# Altium schematic sheet MCU.SchDoc
size A4
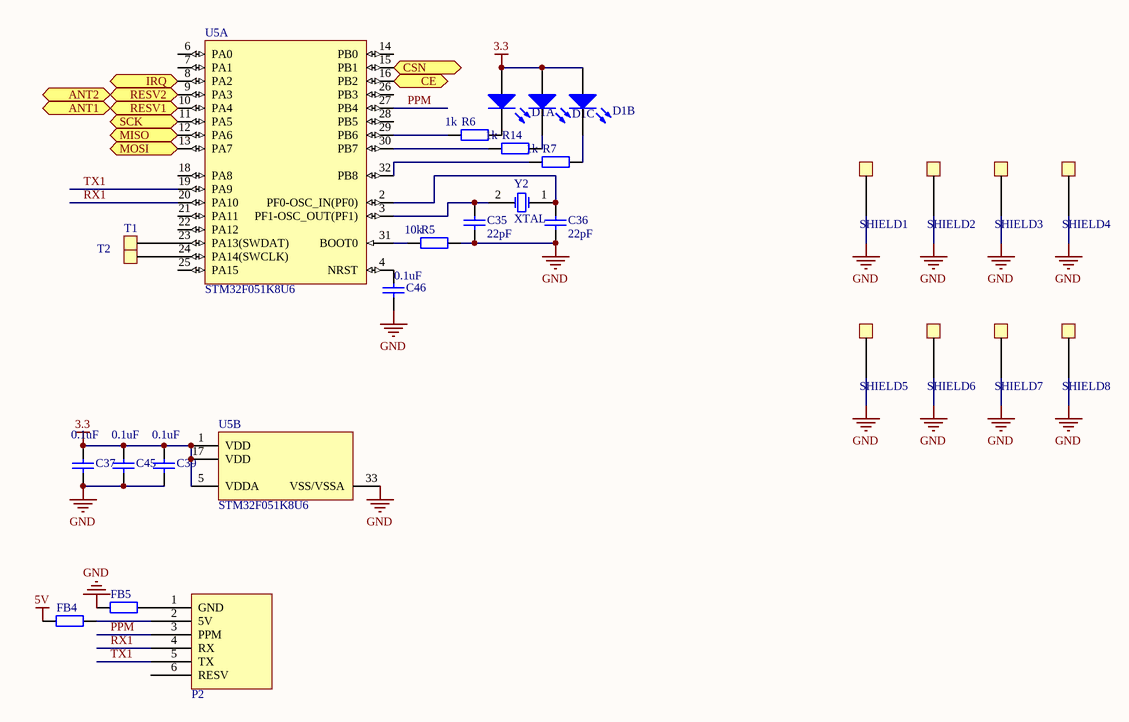
[diagram p0: MCU.SchDoc]

## Parts
C35  22pF  [0402]
C36  22pF  [0402]
C37  0.1uF  [0402]
C39  0.1uF  [0402]
C45  0.1uF  [0402]
C46  0.1uF  [0402]
D1  LEDx3  [LC-0603_Rx2]  (value not drawn)  (parts A,B,C of 3)
FB4  Res2  [0402]  (value not drawn)
FB5  Res2  [0402]  (value not drawn)
P2  PPMInf  [PPMInf]  (value not drawn)
R5  10k  [0402]
R6  1k  [0402]
R7  1k  [0402]
R14  1k  [0402]
SHIELD1  D  [ShieldHolder_6.5*0.8]  (value not drawn)
SHIELD2  D  [ShieldHolder_6.5*0.8]  (value not drawn)
SHIELD3  D  [ShieldHolder_6.5*0.8]  (value not drawn)
SHIELD4  D  [ShieldHolder_6.5*0.8]  (value not drawn)
SHIELD5  D  [ShieldHolder_6.5*0.8]  (value not drawn)
SHIELD6  D  [ShieldHolder_6.5*0.8]  (value not drawn)
SHIELD7  D  [ShieldHolder_6.5*0.8]  (value not drawn)
SHIELD8  D  [ShieldHolder_6.5*0.8]  (value not drawn)
T1  D  [TestPad - 1mm]  (value not drawn)
T2  TestPad  [TestPad - 1mm]  (value not drawn)
U5  STM32F051K8U6  [STM-UFQFPN32_NX]  (parts A,B of 2)
Y2  XTAL  [OSCILLATOR-3.2X2.5 - 2P]

## Ports
ANT1, ANT2, CE, CSN, IRQ, MISO, MOSI, RESV1, RESV2, SCK

## Nets
3.3: C37.1 C39.1 C45.1 D1.2(A) U5.1(VDD) U5.5(VDDA) U5.17(VDD)
5V: FB4.1
GND: C35.2 C36.1 C37.2 C39.2 C45.2 C46.2 FB5.1 R5.2 SHIELD1.1 SHIELD2.1 SHIELD3.1 SHIELD4.1 SHIELD5.1 SHIELD6.1 SHIELD7.1 SHIELD8.1 U5.33(VSS/VSSA)
ANT1: U5.10(PA4) ; port RESV1, port ANT1
ANT2: U5.9(PA3) ; port RESV2, port ANT2
CE: U5.16(PB2) ; port CE
CSN: U5.15(PB1) ; port CSN
IRQ: U5.8(PA2) ; port IRQ
MISO: U5.12(PA6) ; port MISO
MOSI: U5.13(PA7) ; port MOSI
PPM: P2.3(PPM) U5.27(PB4)
RX1: P2.4(RX) U5.20(PA10)
SCK: U5.11(PA5) ; port SCK
TX1: P2.5(TX) U5.19(PA9)
NetC35_1: C35.1 U5.3(PF1-OSC_OUT(PF1)) Y2.2(OSC2)
NetC36_2: C36.2 U5.2(PF0-OSC_IN(PF0)) Y2.1(OSC1)
NetC46_1: C46.1 U5.4(NRST)
NetD1_1: D1.1(K) R6.2
NetD1_3: D1.3(K) R7.2
NetD1_4: D1.4(K) R14.2
NetFB4_2: FB4.2 P2.2(5V)
NetFB5_2: FB5.2 P2.1(GND)
NetR5_1: R5.1 U5.31(BOOT0)
NetR6_1: R6.1 U5.29(PB6)
NetR7_1: R7.1 U5.32(PB8)
NetR14_1: R14.1 U5.30(PB7)
NetT1_1: T1.1 U5.23(PA13(SWDAT))
NetT2_1: T2.1 U5.24(PA14(SWCLK))

Not connected (* = marked no-connect by the designer): P2 6(RESV); U5 6(PA0) 7(PA1) 14(PB0) 18(PA8) 21(PA11) 22(PA12) 25(PA15) 26(PB3) 28(PB5)

## Library data of the parts
C35-C37 C39 C45 C46 = Cap: Capacitor; Published: 8-Jun-2000; LatestRevisionDate: 17-Jul-2002; LatestRevisionNote: Re-released for DXP Platform.; PackageReference: RAD-0.3; Publisher: Altium Limited; PackageDescription: Radial Cap, Thru-Hole; 2 Leads; 0.3 in Pin Spacing
D1 = LEDx3: Typical RED GaAs LED; Published: 8-Jun-2000; LatestRevisionDate: 08-Jul-2005; LatestRevisionNote: Mech Layer 1 removed.; PackageReference: LED-1; Publisher: Altium Limited; PackageDescription: LED; 2 Leads
FB4 FB5 = Res2: Resistor; Value: FB; Published: 8-Jun-2000; LatestRevisionDate: 17-Jul-2002; LatestRevisionNote: Re-released for DXP Platform.; PackageReference: AXIAL-0.4; Publisher: Altium Limited; PackageDescription: Axial Device, Thru-Hole; 2 Leads; 0.4 in Pin Spacing
R5-R7 R14 = Res2: Resistor; Value: 22k 1%; Published: 8-Jun-2000; LatestRevisionDate: 17-Jul-2002; LatestRevisionNote: Re-released for DXP Platform.; PackageReference: AXIAL-0.4; Publisher: Altium Limited; PackageDescription: Axial Device, Thru-Hole; 2 Leads; 0.4 in Pin Spacing
SHIELD1-SHIELD8 T1 = TestPad
U5 = STM32F051K8U6: ARM Cortex-M0 32-bit MCU, 64 KB Flash, 8 KB Internal RAM, 27 I/Os, 32-pin UFQFPN, -40 to 85 degC, Tray; FLASH Size (Prog) (kB): 64; I/Os (High Current): 27; Internal RAM Size (kB): 8; Operating Frequency(F) (Processor speed) (MHz): 48; Supply Voltage(Vcc) min (V): 2; DatasheetVersion: Rev. 3; PackageVersion: Rev. 3, 07/2012; PackageReference: UFQFPN32; PackageDescription: 32-Pin Ultra Thin Fine Pitch Quad Flat No-Lead, 5 x 5 x 0.6 mm Body, 0.5 mm Pitch, Exposed Pad; Supplier 1: Digi-Key; Supplier Part Number 1: 497-12892-ND; Supplier 2: Farnell; Supplier Part Number 2: 2115068; Supplier 3: Newark; Supplier Part Number 3: 05W5805; Supplier 4: Newark; Supplier Part Number 4: 90T0637; Supplier 5: Mouser; Supplier Part Number 5: 511-STM32F051K8U6; Core: ARM Cortex-M0; Packing: Tray; Mounting Technology: Surface Mount; PartNumber: STM32F051K8U6; ComponentLink1Description: Manufacturer URL; ComponentLink1URL: http://www.st.com/web/en/home.html; ComponentLink2Description: Datasheet; ComponentLink2URL: http://www.st.com/st-web-ui/static/active/en/resource/technical/document/datasheet/DM00039193.pdf; ComponentLink3Description: Package Specification; ComponentLink3URL: http://www.st.com/st-web-ui/static/active/en/resource/technical/document/datasheet/DM00039193.pdf
Y2 = XTAL: Crystal Oscillator; Published: 8-Jun-2000; LatestRevisionDate: 17-Jul-2002; LatestRevisionNote: Re-released for DXP Platform.; PackageReference: R38; Publisher: Altium Limited; PackageDescription: Crystal, Thru-Hole; 2 Leads; Body 3.1 x 8.2 mm (Dia.xH)